# EAGLE design PentaFnord_0_9b (EAGLE 5.11)
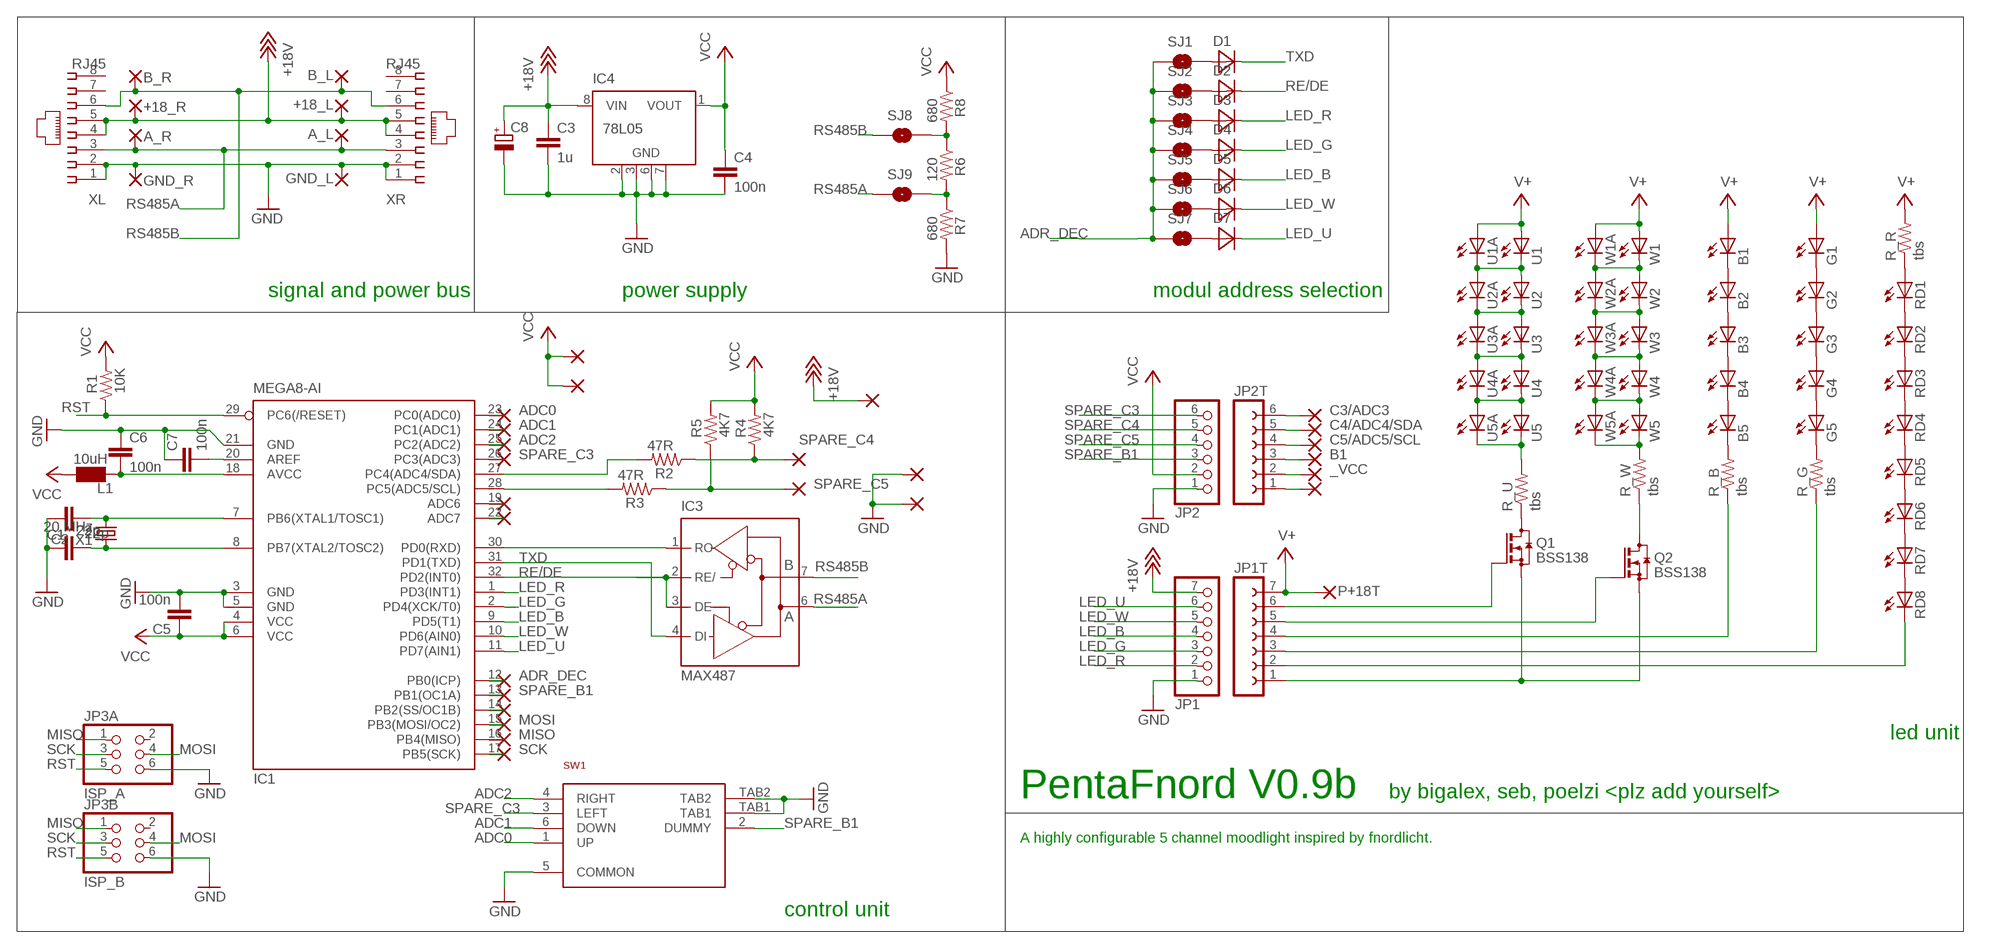
[diagram p0: schematic, sheet 1]

## Parts
+18_L  WIREPADSMD2,54-5,08  [SMD2,54-5,08]
+18_R  WIREPADSMD2,54-5,08  [SMD2,54-5,08]
A_L  WIREPADSMD2,54-5,08  [SMD2,54-5,08]
A_R  WIREPADSMD2,54-5,08  [SMD2,54-5,08]
ADC6  WIREPADSMD1,27-254  [SMD1,27-2,54]
ADC7  WIREPADSMD1,27-254  [SMD1,27-2,54]
B1  LED5MM  [LED5MM]
B2  LED5MM  [LED5MM]
B3  LED5MM  [LED5MM]
B4  LED5MM  [LED5MM]
B5  LED5MM  [LED5MM]
B_L  WIREPADSMD2,54-5,08  [SMD2,54-5,08]
B_R  WIREPADSMD2,54-5,08  [SMD2,54-5,08]
C1  22p  CAP0805  [0805]
C2  22p  CAP0805  [0805]
C3  1u  CAP0805  [0805]
C4  100n  CAP0805  [0805]
C5  100n  CAP0805  [0805]
C6  100n  CAP0805  [0805]
C7  100n  CAP0805  [0805]
C8  CPOL-EUSMCD  [SMC_D]
D1  DIODE_0805  [DIODE_0805]
D2  DIODE_0805  [DIODE_0805]
D3  DIODE_0805  [DIODE_0805]
D4  DIODE_0805  [DIODE_0805]
D5  DIODE_0805  [DIODE_0805]
D6  DIODE_0805  [DIODE_0805]
D7  DIODE_0805  [DIODE_0805]
G1  LED5MM  [LED5MM]
G2  LED5MM  [LED5MM]
G3  LED5MM  [LED5MM]
G4  LED5MM  [LED5MM]
G5  LED5MM  [LED5MM]
GND_L  WIREPADSMD2,54-5,08  [SMD2,54-5,08]
GND_R  WIREPADSMD2,54-5,08  [SMD2,54-5,08]
IC1  MEGA8-AI  [TQFP32-08]
IC3  MAX487  [SO08]
IC4  78L05  78L05SMD  [SO08]
JP1  PINHD-1X07_2.54-SMD-REVERSE  [1X07SMD-REVERSE]
JP1T  FE07-1  [FE07]
JP2  PINHD-1X06_2.54-SMD  [1X06SMD]
JP2T  FE06-1  [FE06]
JP3A  ISP_A  PINHD-2X03_2.54-SMD  [2X03SMD]
JP3B  ISP_B  PINHD-2X03_2.54-SMD  [2X03SMD]
L1  10uH  BEAD  [0805]
P+5T  WIREPAD2,54/0,8  [2,54/0,8]
P+18T  WIREPAD2,54/0,8  [2,54/0,8]
PAD1  WIREPADSMD1,27-254  [SMD1,27-2,54]
PAD2  WIREPADSMD1,27-254  [SMD1,27-2,54]
PAD3  WIREPADSMD1,27-254  [SMD1,27-2,54]
PAD4  WIREPADSMD1,27-254  [SMD1,27-2,54]
PAD5  WIREPADSMD1,27-254  [SMD1,27-2,54]
PB0  WIREPADSMD1,27-254  [SMD1,27-2,54]
PB1  WIREPADSMD1,27-254  [SMD1,27-2,54]
PB1T  WIREPAD2,54/0,8  [2,54/0,8]
PB2  WIREPADSMD1,27-254  [SMD1,27-2,54]
PB3  WIREPADSMD1,27-254  [SMD1,27-2,54]
PB4  WIREPADSMD1,27-254  [SMD1,27-2,54]
PB5  WIREPADSMD1,27-254  [SMD1,27-2,54]
PC0  WIREPADSMD1,27-254  [SMD1,27-2,54]
PC1  WIREPADSMD1,27-254  [SMD1,27-2,54]
PC2  WIREPADSMD1,27-254  [SMD1,27-2,54]
PC3  WIREPADSMD1,27-254  [SMD1,27-2,54]
PC3T  WIREPAD2,54/0,8  [2,54/0,8]
PC4  WIREPADSMD1,27-254  [SMD1,27-2,54]
PC4T  WIREPAD2,54/0,8  [2,54/0,8]
PC5  WIREPADSMD1,27-254  [SMD1,27-2,54]
PC5T  WIREPAD2,54/0,8  [2,54/0,8]
PGNDT1  WIREPAD2,54/0,8  [2,54/0,8]
Q1  BSS138  BSS123  [SOT23]
Q2  BSS138  BSS123  [SOT23]
R1  10K  RESISTOR0805-RES  [0805]
R2  47R  RESISTOR0805-RES  [0805]
R3  47R  RESISTOR0805-RES  [0805]
R4  4K7  RESISTOR0805-RES  [0805]
R5  4K7  RESISTOR0805-RES  [0805]
R6  120  RESISTOR0805-RES  [0805]
R7  680  RESISTOR0805-RES  [0805]
R8  680  RESISTOR0805-RES  [0805]
R_B  tbs  RESISTOR0805-RES  [0805]
R_G  tbs  RESISTOR0805-RES  [0805]
R_R  tbs  RESISTOR0805-RES  [0805]
R_U  tbs  RESISTOR1206  [1206]
R_W  tbs  RESISTOR1206  [1206]
RD1  LED5MM  [LED5MM]
RD2  LED5MM  [LED5MM]
RD3  LED5MM  [LED5MM]
RD4  LED5MM  [LED5MM]
RD5  LED5MM  [LED5MM]
RD6  LED5MM  [LED5MM]
RD7  LED5MM  [LED5MM]
RD8  LED5MM  [LED5MM]
SJ1  SOLDERJUMPERNO  [SJ_2S-NO]
SJ2  SOLDERJUMPERNO  [SJ_2S-NO]
SJ3  SOLDERJUMPERNO  [SJ_2S-NO]
SJ4  SOLDERJUMPERNO  [SJ_2S-NO]
SJ5  SOLDERJUMPERNO  [SJ_2S-NO]
SJ6  SOLDERJUMPERNO  [SJ_2S-NO]
SJ7  SOLDERJUMPERNO  [SJ_2S-NO]
SJ8  SOLDERJUMPERNO  [SJ_2S-NO]
SJ9  SOLDERJUMPERNO  [SJ_2S-NO]
SW1  MCMT5-F-V  [MCMT5-F-V]
U1  NICHIA_NSSL157T-H3  LED_PLCC2  [PLCC2]
U1A  LED5MM  [LED5MM]
U2  NICHIA_NSSL157T-H3  LED_PLCC2  [PLCC2]
U2A  LED5MM  [LED5MM]
U3  NICHIA_NSSL157T-H3  LED_PLCC2  [PLCC2]
U3A  LED5MM  [LED5MM]
U4  NICHIA_NSSL157T-H3  LED_PLCC2  [PLCC2]
U4A  LED5MM  [LED5MM]
U5  NICHIA_NSSL157T-H3  LED_PLCC2  [PLCC2]
U5A  LED5MM  [LED5MM]
W1  NICHIA_NSSL157T-H3  [NICHIA_NSSL157T-H3]
W1A  LED5MM  [LED5MM]
W2  NICHIA_NSSL157T-H3  [NICHIA_NSSL157T-H3]
W2A  LED5MM  [LED5MM]
W3  NICHIA_NSSL157T-H3  [NICHIA_NSSL157T-H3]
W3A  LED5MM  [LED5MM]
W4  NICHIA_NSSL157T-H3  [NICHIA_NSSL157T-H3]
W4A  LED5MM  [LED5MM]
W5  NICHIA_NSSL157T-H3  [NICHIA_NSSL157T-H3]
W5A  LED5MM  [LED5MM]
X1  20 MHz  CRYSTALSMD-SMALLER  [HC49UP-SMALL]
XL  RJ45  RJ45-SMDRJ45-SMALL  [85502-5008-SMALL]
XR  RJ45  RJ45-SMDRJ45-SMALL  [85502-5008-SMALL]

## Nets
+18V: +18_L.1(P) +18_R.1(P) C3.1 C8.+ IC4.8(VIN) JP1.7 PAD2.1(P) XL.4 XL.5 XR.4 XR.5
_VCC: JP2T.2 P+5T.1(P)
ADC0: IC1.23(PC0(ADC0)) PC0.1(P) SW1.1(UP)
ADC1: IC1.24(PC1(ADC1)) PC1.1(P) SW1.6(DOWN)
ADC2: IC1.25(PC2(ADC2)) PC2.1(P) SW1.4(RIGHT)
ADR_DEC: IC1.12(PB0(ICP)) PB0.1(P) SJ1.1 SJ2.1 SJ3.1 SJ4.1 SJ5.1 SJ6.1 SJ7.1
B1: JP2T.3 PB1T.1(P)
C3/ADC3: JP2T.6 PC3T.1(P)
C4/ADC4/SDA: JP2T.5 PC4T.1(P)
C5/ADC5/SCL: JP2T.4 PC5T.1(P)
GND: C1.1 C2.1 C3.2 C4.2 C5.2 C6.1 C7.1 C8.- GND_L.1(P) GND_R.1(P) IC1.3(GND) IC1.5(GND) IC1.21(GND) IC4.2(GND) IC4.3(GND) IC4.6(GND) IC4.7(GND) JP1.1 JP2.1 JP3A.6 JP3B.6 PAD1.1(P) PAD5.1(P) R7.2 SW1.5(COMMON) SW1.TAB1 SW1.TAB2 XL.1 XL.2 XR.1 XR.2
GND_T: JP1T.1 JP2T.1 PGNDT1.1(P) Q1.2(S) Q2.2(S)
LED_B: D5.1(C) IC1.9(PD5(T1)) JP1.4
LED_G: D4.1(C) IC1.2(PD4(XCK/T0)) JP1.3
LED_R: D3.1(C) IC1.1(PD3(INT1)) JP1.2
LED_U: D7.1(C) IC1.11(PD7(AIN1)) JP1.6
LED_W: D6.1(C) IC1.10(PD6(AIN0)) JP1.5
MISO: IC1.16(PB4(MISO)) JP3A.1 JP3B.1 PB4.1(P)
MOSI: IC1.15(PB3(MOSI/OC2)) JP3A.4 JP3B.4 PB3.1(P)
N$1: G5.K(C) R_G.2
N$2: W4.K@1(C) W4A.K(C) W5.A@2(A) W5A.A
N$3: U1.P$1(C) U1A.K(C) U2.P$2(A) U2A.A
N$4: ADC6.1(P) IC1.19(ADC6)
N$5: U3.P$1(C) U3A.K(C) U4.P$2(A) U4A.A
N$6: R_U.2 U5.P$1(C) U5A.K(C)
N$7: R_W.2 W5.K@1(C) W5A.K(C)
N$8: W3.K@1(C) W3A.K(C) W4.A@2(A) W4A.A
N$9: ADC7.1(P) IC1.22(ADC7)
N$10: U2.P$1(C) U2A.K(C) U3.P$2(A) U3A.A
N$11: B1.K(C) B2.A
N$12: U4.P$1(C) U4A.K(C) U5.P$2(A) U5A.A
N$13: G1.K(C) G2.A
N$14: G2.K(C) G3.A
N$15: G3.K(C) G4.A
N$16: G4.K(C) G5.A
N$17: B2.K(C) B3.A
N$18: B3.K(C) B4.A
N$19: B4.K(C) B5.A
N$20: B5.K(C) R_B.2
N$21: RD1.K(C) RD2.A
N$22: RD2.K(C) RD3.A
N$23: RD3.K(C) RD4.A
N$24: RD4.K(C) RD5.A
N$25: RD5.K(C) RD6.A
N$26: RD6.K(C) RD7.A
N$27: R_R.1 RD1.A
N$28: RD7.K(C) RD8.A
N$29: Q1.3(D) R_U.1
N$30: C6.2 IC1.18(AVCC) L1.2
N$31: R6.1 R8.2 SJ8.2
N$32: IC1.30(PD0(RXD)) IC3.1(RO)
N$34: W2.K@1(C) W2A.K(C) W3.A@2(A) W3A.A
N$35: C1.2 IC1.8(PB7(XTAL2/TOSC2)) X1.2
N$36: C2.2 IC1.7(PB6(XTAL1/TOSC1)) X1.1
N$37: Q2.3(D) R_W.1
N$38: R6.2 R7.1 SJ9.2
N$39: JP1T.6 Q1.1(G)
N$40: JP1T.5 Q2.1(G)
N$41: JP1T.3 R_G.1
N$42: JP1T.4 R_B.1
N$43: JP1T.2 RD8.K(C)
N$44: C7.2 IC1.20(AREF)
N$45: D1.2(A) SJ1.2
N$46: D2.2(A) SJ2.2
N$47: D3.2(A) SJ3.2
N$48: D4.2(A) SJ4.2
N$50: D5.2(A) SJ5.2
N$51: D6.2(A) SJ6.2
N$52: D7.2(A) SJ7.2
N$53: IC1.28(PC5(ADC5/SCL)) R3.2
N$54: W1.K@1(C) W1A.K(C) W2.A@2(A) W2A.A
N$55: IC1.14(PB2(SS/OC1B)) PB2.1(P)
N$59: IC1.27(PC4(ADC4/SDA)) R2.2
RE/DE: D2.1(C) IC1.32(PD2(INT0)) IC3.2(RE/) IC3.3(DE)
RS485A: A_L.1(P) A_R.1(P) IC3.6(A) SJ9.1 XL.3 XR.3
RS485B: B_L.1(P) B_R.1(P) IC3.7(B) SJ8.1 XL.6 XR.6
RST: IC1.29(PC6(/RESET)) JP3A.5 JP3B.5 R1.1
SCK: IC1.17(PB5(SCK)) JP3A.3 JP3B.3 PB5.1(P)
SPARE_B1: IC1.13(PB1(OC1A)) JP2.3 PB1.1(P) SW1.2(DUMMY)
SPARE_C3: IC1.26(PC3(ADC3)) JP2.6 PC3.1(P) SW1.3(LEFT)
SPARE_C4: JP2.5 PC4.1(P) R2.1 R4.1
SPARE_C5: JP2.4 PC5.1(P) R3.1 R5.1
TXD: D1.1(C) IC1.31(PD1(TXD)) IC3.4(DI)
V+: B1.A G1.A JP1T.7 P+18T.1(P) R_R.2 U1.P$2(A) U1A.A W1.A@2(A) W1A.A
VCC: C4.1 C5.1 IC1.4(VCC) IC1.6(VCC) IC4.1(VOUT) JP2.2 L1.1 PAD3.1(P) PAD4.1(P) R1.2 R4.2 R5.2 R8.1
Unconnected: IC4.4(NC) IC4.5(NC) JP3A.2 JP3B.2 XL.7 XL.8 XR.7 XR.8

## Notes on the sheet
- signal and power bus | power supply | modul address selection
- led unit
- PentaFnord V0.9b | by bigalex, seb, poelzi <plz add yourself>
- A highly configurable 5 channel moodlight inspired by fnordlicht.
- control unit

## Power pins joined to a net without a drawn wire
GND: IC3.5(GND)
VCC: IC3.8(VCC)

## Library data of the parts
+18_L +18_R A_L A_R ADC6 ADC7 B_L B_R GND_L GND_R P+5T P+18T PAD1-PAD5 PB0 PB1 PB1T PB2-PB5 PC0 PC1-PC3 PC3T PC4 PC4T PC5 PC5T PGNDT1 = wirepad:WIREPAD: Wire PAD connect wire on PCB
B1-B5 G1-G5 RD1-RD8 U1A U2A U3A U4A U5A W1A W2A W3A W4A W5A = Alex_personal:LED: LED OSRAM: - CHIPLED LG R971, LG N971, LY N971, LG Q971, LY Q971, LO R971, LY R971 LH N974, LH R974 LS Q976, LO Q976, LY Q976 LO Q996 - Hyper CHIPLED LW Q18S LB Q993, LB Q99A, LB R99A - SideLED LS A670, LO A670, LY A670, LG A670, LP A670 LB A673, LV A673, LT A673, LW A673 LH A674 LY A675 LS A676, LA A676, LO A676, LY A676, LW A676 LS A679, LY A679, LG A679 - Hyper Micro SIDELED® LS Y876, LA Y876, LO Y876, LY Y876 LT Y87S - SmartLED LW L88C, LW L88S LB L89C, LB L89S, LG L890 LS L89K, LO L89K, LY L89K LS L896, LA L896, LO L896, LY L896 - TOPLED LS T670, LO T670, LY T670, LG T670, LP T670 LSG T670, LSP T670, LSY T670, LOP T670, LYG T670 LG T671, LOG T671, LSG T671 LB T673, LV T673, LT T673, LW T673 LH T674 LS T676, LA T676, LO T676, LY T676, LB T676, LH T676, LSB T676, LW T676 LB T67C, LV T67C, LT T67C, LS T67K, LO T67K, LY T67K, LW E67C LS E67B, LA E67B, LO E67B, LY E67B, LB E67C, LV E67C, LT E67C LW T67C LS T679, LY T679, LG T679 LS T770, LO T770, LY T770, LG T770, LP T770 LB T773, LV T773, LT T773, LW T773 LH T774 LS E675, LA E675, LY E675, LS T675 LS T776, LA T776, LO T776, LY T776, LB T776 LHGB T686 LT T68C, LB T68C - Hyper Mini TOPLED® LB M676 - Mini TOPLED Santana® LG M470 LS M47K, LO M47K, LY M47K Source: http://www.osram.convergy.de LUXEON: - LUMILED® LXK2-PW12-R00, LXK2-PW12-S00, LXK2-PW14-U00, LXK2-PW14-V00 LXK2-PM12-R00, LXK2-PM12-S00, LXK2-PM14-U00 LXK2-PE12-Q00, LXK2-PE12-R00, LXK2-PE12-S00, LXK2-PE14-T00, LXK2-PE14-U00 LXK2-PB12-K00, LXK2-PB12-L00, LXK2-PB12-M00, LXK2-PB14-N00, LXK2-PB14-P00, LXK2-PB14-Q00 LXK2-PR12-L00, LXK2-PR12-M00, LXK2-PR14-Q00, LXK2-PR14-R00 LXK2-PD12-Q00, LXK2-PD12-R00, LXK2-PD12-S00 LXK2-PH12-R00, LXK2-PH12-S00 LXK2-PL12-P00, LXK2-PL12-Q00, LXK2-PL12-R00 Source: www.luxeon.com KINGBRIGHT: KA-3528ASYC Source: www.kingbright.com
C1-C7 = SparkFun:CAP: Capacitor Standard 0603 ceramic capacitor, and 0.1" leaded capacitor.
C8 = rcl:CPOL-EU: POLARIZED CAPACITOR, European symbol
D1-D7 = seb:DIODE_0805
IC1 = atmel:MEGA8: MICROCONTROLLER 8 Kbytes FLASH, 1 kbytes SRAM, 512 bytes EEPROM, USART, 6-channel 10 bit ADC, 2-channel 8 bit ADC Pin compatible with Atmega48, ATMega88, ATMega168 Source: avr.lbr; MPN: ATMEGA8-16AU; OC_FARNELL: 9171371; OC_NEWARK: 73M8863
IC3 = Alex_personal:MAX487: RS485 TRANSEIVER; MF: MAXIM; MPN: MAX487; OC_FARNELL: unknown; OC_NEWARK: unknown
IC4 = linear:78L*SMD: Positive VOLTAGE REGULATOR
JP1 = Alex_personal:PINHD-1X07: PIN HEADER
JP1T = con-lsta:FE07-1: FEMALE HEADER; OC_FARNELL: unknown; OC_NEWARK: unknown
JP2 = pinhead-2:PINHD-1X06: PIN HEADER
JP2T = con-lsta:FE06-1: FEMALE HEADER; OC_FARNELL: unknown; OC_NEWARK: unknown
JP3A JP3B = pinhead-2:PINHD-2X03: PIN HEADER
L1 = seb:BEAD
Q1 Q2 = transistor-small-signal:BSS123: N-CHANNEL MOS FET
R1-R8 R_B R_G R_R R_U R_W = SparkFun:RESISTOR: Resistor Basic schematic elements and footprints for 0603, 1206, and PTH resistors.
SJ1-SJ9 = SparkFun:SOLDERJUMPER: Solder Jumper Standard SMD solder jumper. Used to automate production. Two varients : Normally Open and Normally Closed are the same, but have different paste layers. NC will have a large amount of paste and should jumper during reflow.
SW1 = badge:MCMT5-F-V
U1-U5 = seb:LED_PLCC2
W1-W5 = seb:NICHIA_NSSL157T-H3
X1 = Alex_personal:CRYSTAL: Crystals Various standard crystals. Proven footprints. Spark Fun Electronics SKU : COM-00534
XL XR = Alex_personal:RJ45-SMD: AMP connector

## Board
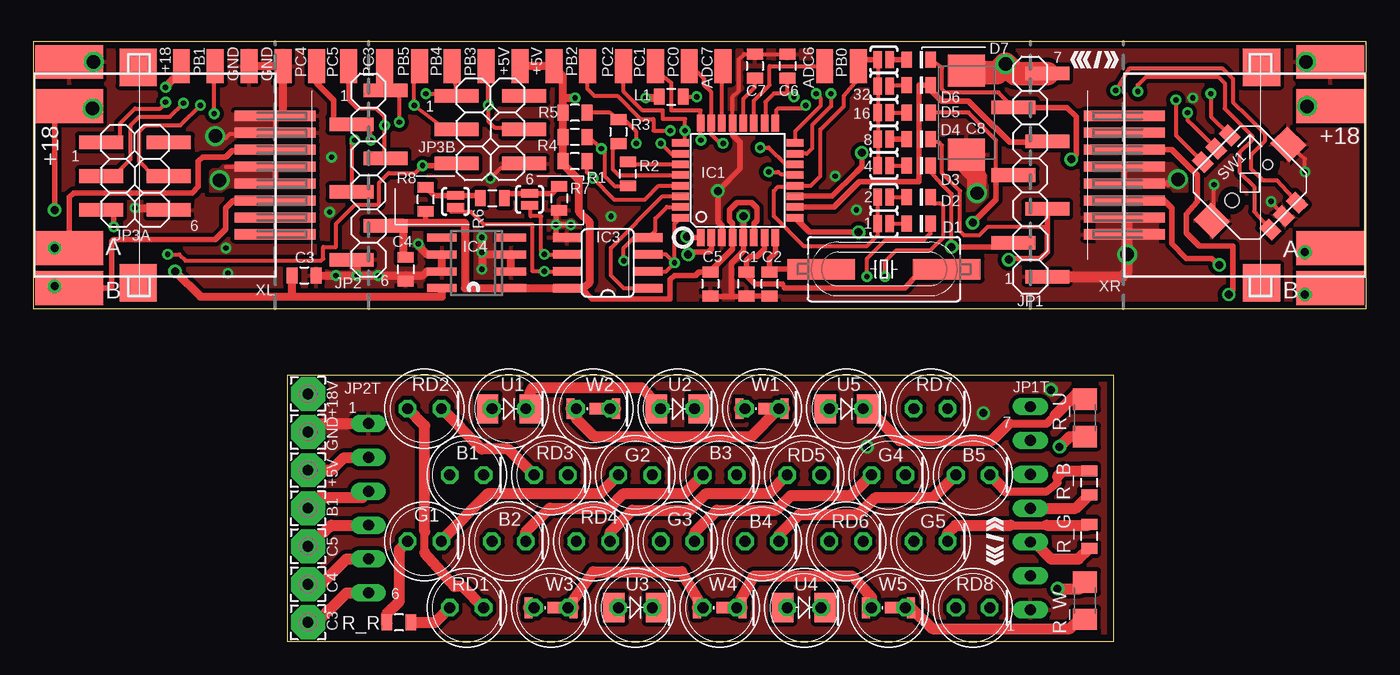
[diagram p1: board, top side]
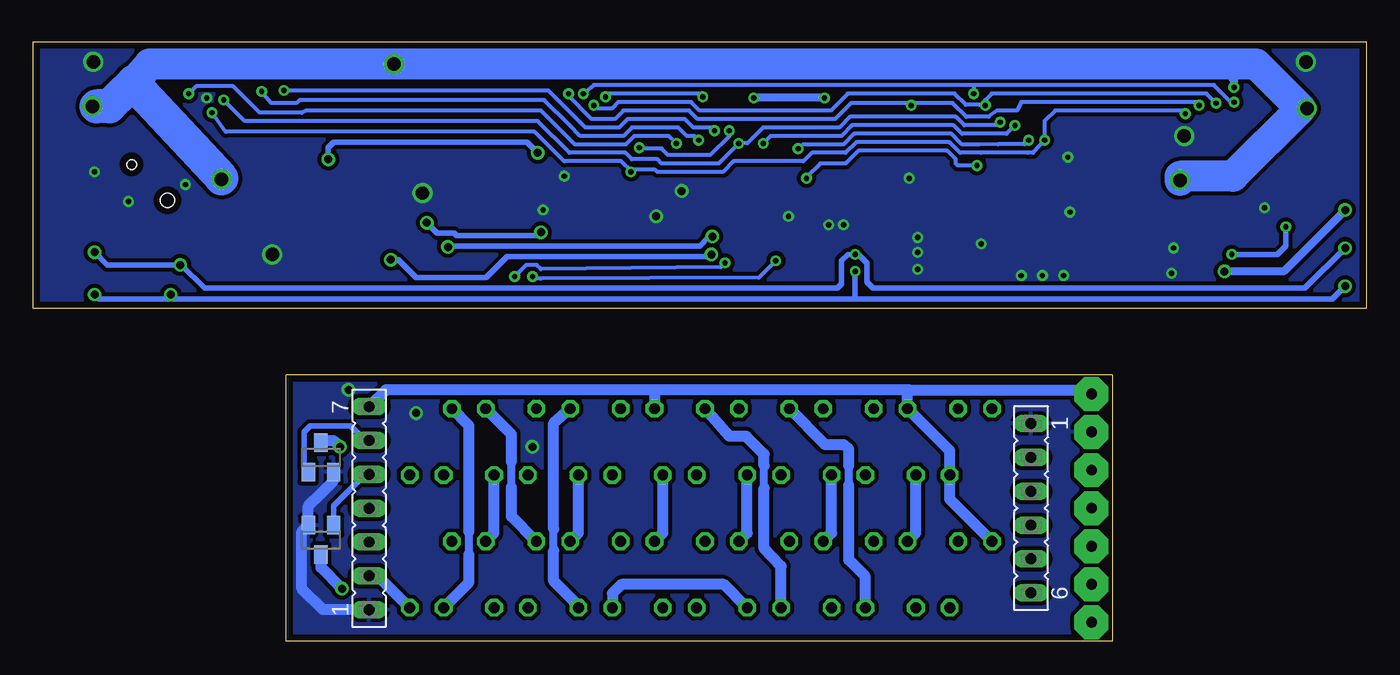
[diagram p2: board, bottom side, seen from below]

Size 100 x 45 mm. Coordinates in mm from the lower left corner, seen from the top.
Outline: 19.05,0 81.05,0 81.05,20 19.05,20 19.05,0
Outline: 100,25 100,45 0,45 0,25 100,25
Copper layers (1*16): Top 0.035mm / dielectric 1.5mm / Bottom 0.035mm
Design rules "default *": minimum track width 12mil, minimum drill 0.4mm, track to track 10mil, track to pad 10mil, pad to pad 8mil, via to via 10mil, smd to smd 8mil, copper to edge 20mil, drill to drill 8mil, minimum pad ring 10mil, minimum via ring 8mil, stop-mask expansion 4mil, vias tented up to drill 40mil, thermal gap 10mil

### Footprints (pad centres in the part's own frame; a part is rotated, then mirrored left to right if it is on the bottom)
SMD2,54-5,08 = smd 2.54 x 5.08: 1 0,0
SMD1,27-2,54 = smd 1.27 x 2.54: 1 0,0
LED5MM = drill 0.813 octagon: A -1.27,0; K 1.27,0
0805 = smd 0.8 x 1.2: 1 -0.9,0; 2 0.9,0
SMC_D = smd 2.4 x 2.8: + -3.15,0; - 3.15,0
DIODE_0805 = smd 0.8 x 1.2: 1 -0.9,0; 2 0.9,0
TQFP32-08 = smd 1.27 x 0.559: 1 -4.293,2.8; 2 -4.293,2; 3 -4.293,1.2; 4 -4.293,0.4; 5 -4.293,-0.4; 6 -4.293,-1.2; 7 -4.293,-2; 8 -4.293,-2.8; 17 4.293,-2.8; 18 4.293,-2; 19 4.293,-1.2; 20 4.293,-0.4; 21 4.293,0.4; 22 4.293,1.2; 23 4.293,2; 24 4.293,2.8 | smd 0.559 x 1.27: 9 -2.8,-4.293; 10 -2,-4.293; 11 -1.2,-4.293; 12 -0.4,-4.293; 13 0.4,-4.293; 14 1.2,-4.293; 15 2,-4.293; 16 2.8,-4.293; 25 2.8,4.293; 26 2,4.293; 27 1.2,4.293; 28 0.4,4.293; 29 -0.4,4.293; 30 -1.2,4.293; 31 -2,4.293; 32 -2.8,4.293
SO08 = smd 0.66 x 2.032: 1 -1.905,-3.073; 2 -0.635,-3.073; 3 0.635,-3.073; 4 1.905,-3.073; 5 1.905,3.073; 6 0.635,3.073; 7 -0.635,3.073; 8 -1.905,3.073
SO08' = smd 0.6 x 2.2: 1 -1.905,-2.6; 2 -0.635,-2.6; 3 0.635,-2.6; 4 1.905,-2.6; 5 1.905,2.6; 6 0.635,2.6; 7 -0.635,2.6; 8 -1.905,2.6
1X07SMD-REVERSE = smd 1.016 x 3.302: 1 -1.27,-1.27; 2 1.27,1.27; 3 3.81,-1.27; 4 6.35,1.27; 5 8.89,-1.27; 6 11.43,1.27; 7 13.97,-1.27
FE07 = drill 0.813 long: 1 -7.62,0; 2 -5.08,0; 3 -2.54,0; 4 0,0; 5 2.54,0; 6 5.08,0; 7 7.62,0
1X06SMD = smd 1.016 x 3.302: 1 -1.27,1.27; 2 1.27,-1.27; 3 3.81,1.27; 4 6.35,-1.27; 5 8.89,1.27; 6 11.43,-1.27
FE06 = drill 0.813 long: 1 -6.35,0; 2 -3.81,0; 3 -1.27,0; 4 1.27,0; 5 3.81,0; 6 6.35,0
2X03SMD = smd 1.016 x 3.302: 1 -1.27,-3.81; 2 -1.27,1.27; 3 1.27,-3.81; 4 1.27,1.27; 5 3.81,-3.81; 6 3.81,1.27
2,54/0,8 = drill 0.813 pad 2.54 octagon: 1 0,0
SOT23 = smd 1 x 1.4: 1 -0.95,-1.1; 2 0.95,-1.1; 3 0,1.1
1206 = smd 1.6 x 1.8: 1 -1.4,0; 2 1.4,0
SJ_2S-NO = smd 0.635 x 1.27: 1 -0.45,0; 2 0.45,0
MCMT5-F-V = smd 1.35 x 1: 1 -3.575,1.425; 2 -3.575,0; 3 -3.575,-1.425; 4 3.575,1.425; 5 3.575,0; 6 3.575,-1.425 | smd 2 x 1.8: TAB1 0,4.05; TAB2 0,-4.05 | hole 1.05: 0,-1.9 | hole 0.75: 0,1.9
PLCC2 = smd 1.6 x 2.2: P$1 -1.6,0; P$2 1.6,0
NICHIA_NSSL157T-H3 = smd 0.64 x 0.86: A@1 1.08,0 | smd 0.6 x 1.55: A@2 1.7,0; K@1 -1.7,0 | smd 1.66 x 0.86: K@2 -0.57,0
HC49UP-SMALL = smd 5.08 x 1.524: 1 -4.699,0; 2 4.699,0
85502-5008-SMALL = smd 6.096 x 0.762: 1 10.211,4.445; 2 10.211,3.175; 3 10.211,1.905; 4 10.211,0.635; 5 10.211,-0.635; 6 10.211,-1.905; 7 10.211,-3.175; 8 10.211,-4.445 | smd 2.794 x 2.794: P$1 -0.076,-8.077; P$2 -0.076,8.077

### Placement (x,y rotation side)
+18_L  2.7,40.16 90 top
+18_R  97.31,40.16 90 top
A_L  2.7,29.53 90 top
A_R  97.31,29.53 90 top
ADC6  59.37,43.18 0 top
ADC7  51.75,43.18 180 top
B1  32.51,12.49 0 top
B2  35.68,7.51 0 top
B3  51.5,12.49 0 top
B4  54.67,7.51 0 top
B5  70.49,12.49 0 top
B_L  2.7,26.51 90 top
B_R  97.31,26.51 90 top
C1  55.24,26.83 90 top
C2  53.5,26.83 90 top
C3  20.32,27.46 0 top
C4  27.94,27.94 270 top
C5  50.8,26.83 270 top
C6  56.59,43.18 270 top
C7  54.13,43.18 270 top
C8  70.01,39.69 270 top
D1  66.44,31.35 180 top
D2  66.44,33.34 180 top
D3  66.44,35.72 180 top
D4  66.44,37.7 180 top
D5  66.44,39.69 180 top
D6  66.44,41.75 180 top
D7  66.44,43.66 180 top
G1  29.35,7.51 0 top
G2  45.17,12.49 0 top
G3  48.34,7.51 0 top
G4  64.16,12.49 0 top
G5  67.33,7.51 0 top
GND_L  2.7,43.5 90 top
GND_R  97.31,43.5 90 top
IC1  52.86,34.61 90 top
IC3  43.1,28.42 90 top
IC4  78L05  [SO08']  33.26,28.42 90 top
JP1  74.8,28.65 90 top
JP1T  74.8,10 90 bottom
JP2  25.15,29.92 90 top
JP2T  25.15,10 270 bottom
JP3A  8.89,36.19 270 top
JP3B  35.56,39.69 270 top
L1  47.86,40.88 0 top
P+5T  20.61,12.86 0 top
P+18T  20.61,18.57 0 top
PAD1  16.19,43.18 0 top
PAD2  11.11,43.18 0 top
PAD3  39.05,43.18 0 top
PAD4  36.51,43.18 0 top
PAD5  18.73,43.18 0 top
PB0  61.91,43.18 180 top
PB1  13.65,43.18 180 top
PB1T  20.61,10 0 top
PB2  41.59,43.18 180 top
PB3  33.97,43.18 180 top
PB4  31.43,43.18 180 top
PB5  28.97,43.18 180 top
PC0  49.21,43.18 0 top
PC1  46.67,43.18 0 top
PC2  44.29,43.18 0 top
PC3  26.35,43.18 0 top
PC3T  20.61,1.43 0 top
PC4  21.27,43.18 0 top
PC4T  20.61,4.29 0 top
PC5  23.65,43.18 0 top
PC5T  20.61,7.14 0 top
PGNDT1  20.61,15.72 0 top
Q1  78.42,13.81 0 bottom
Q2  78.42,7.62 180 bottom
R1  40.64,36.04 180 top
R2  44.61,35.08 90 top
R3  43.89,38.26 270 top
R4  40.64,37.86 180 top
R5  40.64,39.69 180 top
R6  34.45,33.26 0 top
R7  39.45,33.26 270 top
R8  29.45,33.18 90 top
R_B  79.22,11.91 90 top
R_G  79.22,7.89 90 top
R_R  27.43,1.43 180 top
R_U  78.9,16.78 90 top
R_W  78.9,3.06 270 top
RD1  32.51,2.53 0 top
RD2  29.35,17.47 0 top
RD3  38.84,12.49 0 top
RD4  42.01,7.51 0 top
RD5  57.83,12.49 0 top
RD6  61,7.51 0 top
RD7  67.33,17.47 0 top
RD8  70.49,2.53 0 top
SJ1  63.82,31.35 0 top
SJ2  63.82,33.34 0 top
SJ3  63.82,35.72 0 top
SJ4  63.82,37.7 0 top
SJ5  63.82,39.69 0 top
SJ6  63.82,41.67 0 top
SJ7  63.82,43.66 0 top
SJ8  31.67,33.02 90 top
SJ9  37.23,33.18 90 top
SW1  91.28,34.45 315 top
U1  35.68,17.45 180 top
U1A  35.68,17.47 0 top
U2  48.34,17.46 180 top
U2A  48.34,17.47 0 top
U3  45.16,2.55 180 top
U3A  45.17,2.53 0 top
U4  57.82,2.55 180 top
U4A  57.83,2.53 0 top
U5  61,17.46 180 top
U5A  61,17.47 0 top
W1  54.67,17.47 180 top
W1A  54.67,17.47 0 top
W2  42.01,17.47 180 top
W2A  42.01,17.47 0 top
W3  38.84,2.53 180 top
W3A  38.84,2.53 0 top
W4  51.5,2.53 180 top
W4A  51.5,2.53 0 top
W5  64.16,2.53 180 top
W5A  64.16,2.53 0 top
X1  63.82,27.94 180 top
XL  7.94,35 0 top
XR  92.08,35 180 top

### Tracks (layer width: path | path; a pad name or v marks a point on that pad's centre or on a via)
+18V  (via drill 0.4, 0.6, 1)
  Top 0.305: 11.11,42.86 PAD2.1 | +18_L.1 | 14.45,35.63 XL.4
  Top 0.406: 97.16,40.16 +18_R.1 | XL.4 XL.5 | 81.76,35.62 XR.5 XR.4 85.17,34.37 | 1.67,32.46 1.59,32.46 1.59,39.53 +18_L.1 v4.45,40.01 | 14.13,34.61 13.49,34.45 | 97.16,40.16 | v95.57,40.16 97.16,40.16
  Top 0.61: v1.59,32.38 1.67,32.46 | v10.64,27.78 12.54,25.88 19.53,25.88 | 19.53,25.88 30.66,25.88 IC4.8 | C3.1 19.42,25.98 19.53,25.88 | JP1.7 75.64,42.62 75.56,42.7 | v9.92,41.59 11.11,42.86 | 70.14,42.7 arc-90 C8.+ | 85.17,34.37 85.88,34.76 v85.88,34.69
  Top 1.778: 70.14,42.7 72.31,42.7 v72.95,43.34 73.67,42.62 JP1.7
  Bottom 0.305: 9.53,43.33 10.32,42.54 | 5.4,39.53 4.6,39.53 4.45,39.37 v4.45,40.01 5.56,39.53 5.4,39.53 | 5.4,39.53 4.92,40.01 | v13.97,34.61 14.45,35.4 14.45,34.92 13.97,34.92
  Bottom 0.406: 42.55,43.81 43.34,43.81 43.34,43.33 | 85.57,34.77 85.88,34.77 | 73.74,42.7 74.14,43.34 77.95,43.33 | v95.57,40.16 94.85,40.88 93.58,40.88
  Bottom 0.61: v1.59,32.38 6.19,27.78 v10.64,27.78 | 10.32,42.54 9.92,42.14 v9.92,41.59 | 73.74,42.7 73.1,43.34 v72.95,43.34 | 85.57,34.77 86.52,35.72 | 86.52,35.72 87,35.72 86.04,34.77 | 86.04,34.77 | 86.52,35.72 86.68,35.88 v85.88,34.69
  Bottom 2.311: 92.47,41.99 91.28,43.33 77.95,43.33 43.34,43.33 9.53,43.33 8.25,43.33 4.92,40.01 10,34.92 13.97,34.92 v13.97,34.61
  Bottom 2.54: 95.25,40.16 94.3,40.16 93.58,40.88 92.47,41.99 92.47,41.83 85.88,34.77
  pour Top (no thermals): 86.52,33.81 85.57,33.81 85.41,34.13 81.76,34.13 81.76,35.72 81.92,35.88 85.41,35.88 86.52,34.77
  pour Top (no thermals): 13.49,35.4 13.97,35.4 14.29,35.72 18.1,35.72 18.26,35.56 18.26,34.45 15.24,34.45 14.92,34.13 14.61,34.13 14.13,33.81 13.34,33.81 13.34,35.24
_VCC
  Top 0.813: JP2T.2 23.34,13.81 22.38,12.86 P+5T.1
ADC0  (via drill 0.4)
  Top 0.305: v88.34,41.12 88.34,39.4 SW1.1 | PC0.1 49.37,42.23 | 49.37,42.23 | PC0.1 49.21,42.39 | PC0.1 49.37,43.18 50.32,42.23 50.32,41.75 50.86,41.21 IC1.23 50.86,38.04 51.51,37.39 v51.75,37.39
  Bottom 0.305: v88.34,41.12 87.79,41.67 85.01,41.67 83.03,39.69 80.8,39.69 79.85,39.69 79.53,39.85 61.91,39.85 59.37,37.31 55.56,37.31 54.93,37.94 52.31,37.94 v51.75,37.39
ADC1  (via drill 0.4, 0.4 pad 0.01)
  Top 0.305: 92.71,30.48 SW1.6 91.6,32.27 91.6,34.13 90.49,35.24 90.49,36.67 91.44,37.62 91.44,37.94 89.38,40.01 89.38,41.91 88.9,42.39 83.5,42.39 82.87,41.75 v82.87,41.27 | PC1.1 46.83,43.02 46.83,42.7 46.91,42.7 47.86,41.91 47.86,39.85 50.07,39.85 IC1.24 50.06,37.65 v50.09,37.62
  Bottom 0.305: v82.87,41.27 82.15,40.4 80.25,40.4 80.01,40.64 78.74,40.64 61.67,40.64 59.73,38.7 58.98,37.94 55.72,37.94 55.09,38.58 51.59,38.58 50.96,37.94 50.4,37.94 v50.09,37.62
ADC2  (via drill 0.4)
  Top 0.305: 95.25,33.02 SW1.4 93.3,34.61 92.23,34.61 91.36,35.48 91.36,36.51 92.39,37.54 92.39,38.1 91.12,39.37 | 91.12,39.37 | 91.12,39.37 90.01,40.48 90.01,42.23 89.22,43.02 82.23,43.02 v81.2,41.35 | IC1.25 48.9,37.41 v48.9,38.34 48.9,39.21 47.23,39.21 47.23,39.85 45.72,39.85 44.29,41.28 PC2.1
  Bottom 0.305: v81.2,41.35 61.36,41.35 58.58,38.58 56.04,38.58 55.4,39.21 51.12,39.21 50.48,38.58 49.13,38.58 v48.9,38.34
ADR_DEC
  Top 0.305: SJ7.1 SJ6.1 | 62.05,43.61 61.91,43.47 61.91,42.23 60.8,40.96 60.8,40.16 59.05,38.42 59.05,34.92 58.34,34.21 IC1.12 57.08,34.13 55.88,34.13 55.56,33.81 55.56,31.91 57.78,29.69 62.55,29.69 63.37,30.51 SJ1.1 | SJ1.1 | SJ1.1 SJ2.1 | SJ6.1 | SJ6.1 | SJ6.1 SJ5.1 SJ4.1 | SJ4.1 | SJ4.1 SJ3.1
  Top 0.406: PB0.1 62.05,43.61 62.07,43.66 SJ7.1
B1
  Top 0.813: PB1T.1 21.24,10.79 24.67,10.79 JP2T.3
C3/ADC3
  Top 0.813: JP2T.6 23.49,3.65 21.27,1.43 PC3T.1
C4/ADC4/SDA
  Top 0.813: JP2T.5 23.49,6.19 21.59,4.29 PC4T.1
C5/ADC5/SCL
  Top 0.813: JP2T.4 22.35,8.73 PC5T.1
GND  (via drill 0.4, 0.6, 1)
  Top 0.305: C7.1 53.34,44.08 52.94,43.68 52.94,41.35 52.46,40.88 52.46,40.25 IC1.21 | 36.83,35.56 35.08,35.56 v34.29,34.77 | C7.1 | C7.1 C6.1 | v92.87,33.02 | SW1.5 v92.87,33.02 | v95.41,35.24 95.41,36.21 SW1.TAB1 | v88.58,34.29 88.58,31.59 SW1.TAB2 | XL.1 XL.2 18.2,38.1 14.76,38.1 14.45,37.78 | v13.65,37.94 14.45,37.78 | 13.65,38.26 13.97,38.26 14.45,37.78 | 13.65,37.39 13.57,37.54 13.18,37.94
  Top 0.406: 96.52,42.86 GND_R.1 | SW1.TAB1 93.99,36.66 | IC3.5 39.21,30.32 v39.21,31.27 | v39.21,31.27 v40.32,31.27 | 36.83,35.56 JP3B.6 | R7.2 39.21,32.12 v39.21,31.27 | IC1.21 52.46,38.02 53.02,37.47 53.02,35.48 v51.36,33.81 51.36,31.51 51.66,31.2 IC1.3 | 53.26,29.29 IC1.5 v53.26,31.91 | 52.39,25.88 53.45,25.88 C2.1 C1.1 | 53.26,29.29 | 53.26,29.29 52.39,28.42 52.39,25.88 | 52.39,25.88 50.85,25.88 C5.2
  Top 0.61: 10.95,32.38 JP3A.6 9.84,32.54 v7.62,32.54 | 3.02,43.18 3.49,43.18 3.25,42.94 3.02,43.18 | 3.02,43.18 GND_L.1 | 3.02,43.18 | 22.54,28.73 23.79,28.73 JP2.1 24.29,28.24 v24.29,27.46 | C3.2 v22.7,27.46 | v22.7,27.46 | v22.7,27.46 v24.29,27.46 | v24.29,27.46 | v24.29,27.46 27.94,27.46 | 27.94,27.46 29.21,27.46 29.53,27.78 IC4.7 IC4.6 29.53,29.05 28.89,29.69 v28.89,29.84 | 27.94,27.46 C4.2 | IC4.2 IC4.3 33.81,29.05 arc-90 v33.66,29.21 | v33.66,29.21 v33.66,27.94 | v33.66,29.21 v33.66,30.32 | PAD1.1 PAD5.1 18.73,39.45 XL.1 | 71.28,33.81
  Top 0.813: 82.07,30.89 82.07,31.49 XR.2 | 82.07,30.89 v82.07,29.05 82.07,27.78 81.67,27.38 JP1.1 | 82.07,30.89 XR.1
  Top 1.422: v70.8,33.66 | v70.8,33.66 70.8,34.92 70.01,35.72 C8.-
  other vias: 4.52,43.5 95.49,43.5 25.88,27.46 14.45,29.53 14.61,27.62 43.34,31.91 22.38,36.35 22.23,32.23 87,40.8 61.75,32.38 60.17,34.92
  pour Bottom (isolate 0.305): -0.16,24.92 100.17,24.92 100.17,45.09 -0.16,45.09
  pour Top (isolate 0.305, rank 2): 100.17,45.09 100.17,24.92 -0.16,24.92 -0.16,45.09
  pour Top (no thermals): 79.85,28.42 79.85,31.59 84.3,31.59 84.3,28.42
  pour Top (no thermals): 18.26,39.53 14.76,39.53 13.97,38.58 13.02,38.26 13.02,37.47 13.34,37.15 13.81,37.15 14.13,37.47 14.76,37.47 15.24,37.94 18.26,37.94
GND_T  (via drill 0.6)
  Top 0.813: JP2T.1 21.08,16.35 PGNDT1.1
  Bottom 0.813: Q1.2 77.47,12.06 78.42,11.11 79.37,10.16 Q2.2 79.85,8.24 79.85,3.97 78.26,2.38 JP1T.1
  other vias: 62.55,14.61 76.36,18.89 71.28,17.14
  pour Bottom (isolate 0.305): 19.05,20 81.05,20 81.05,0 19.05,0
  pour Top (isolate 0.305): 19.05,20 81.05,20 81.05,0 19.05,0
LED_B  (via drill 0.6)
  Top 0.305: 72.55,35.4 73.18,34.77 73.3,34.77 JP1.4 | D5.1 70.17,39.69 72.23,37.62 72.23,34.92
  Top 0.406: IC1.9 58.24,30.72 v61.91,30.72 | v70.48,31.43 72.23,33.18 72.23,34.92 72.23,35.08 72.31,35 JP1.4
  Bottom 0.406: v61.91,30.72 62.15,30.48 68.26,30.48 68.42,30.64 69.69,30.64 v70.48,31.43
LED_G  (via drill 0.6)
  Top 0.305: D4.1 67.5,37.47 67.94,37.47 68.18,37.23 68.18,35.16 69.53,33.81 69.53,30.8 69.85,30.48 70.96,30.48 71.6,31.11 75.75,31.11 arc-90 76.07,30.8
  Top 0.406: v49.13,29.05 49.29,29.21 50.64,29.21 50.86,29.43 IC1.2 | JP1.3 76.07,30.8 76.07,29.24 75.56,28.73 73.26,28.73 v73.18,28.65
  Bottom 0.406: v49.13,29.05 49.29,28.89 64.45,28.89 66.04,27.3 71.28,27.3 72.63,28.65 v73.18,28.65
LED_R  (via drill 0.6)
  Top 0.305: D3.1 67.34,35.22 68.18,34.29 68.9,33.58 v68.9,29.61
  Top 0.406: IC1.1 49.14,30.32 v49.05,30.4 | JP1.2 72.16,29.92 72.07,30 72.07,29.61 v68.9,29.61
  Bottom 0.406: v49.05,30.4 49.14,30.32 49.37,30.32 50,29.69 68.82,29.69 arc-90 v68.9,29.61
LED_U  (via drill 0.6)
  Top 0.305: D7.1 68.18,43.05 68.18,41.43 68.42,41.2 72.42,41.2 JP1.6
  Top 0.406: IC1.11 59.92,33.41 61.75,35.24 | v77.87,36.2 78.26,36.59 78.26,39.37 77.55,40.08 JP1.6 | 61.75,35.24 | 61.75,35.24 62.15,35.64 v62.15,36.67
  Bottom 0.406: v62.15,36.67 62.94,37.47 77.47,37.47 77.87,37.07 v77.87,36.2
LED_W
  Top 0.406: 76.12,37.54 JP1.5 75.99,37.46 73.27,37.46 70.96,39.77 | IC1.10 60.07,32.61 61.99,34.53 66.44,34.53 66.44,41.75 D6.1 | D6.1 | 70.96,39.77 | D6.1 67.47,41.62 67.47,41.27 68.18,40.56 70.17,40.56 70.96,39.77
MISO  (via drill 0.4)
  Top 0.305: PB4.1 31.59,43.02 JP3B.1 31.59,41.12 v29.45,41.12 | IC1.16 57.16,38.27 59.05,40.16 59.05,40.8 v58.74,41.12 | 5.08,37.62 5.24,37.78 6.51,37.78 6.51,38.89 7.62,40.01 9.53,40.01 9.92,40.4 v9.92,40.48
  Top 0.406: JP3A.1 5.08,37.62 4.92,37.47
  Bottom 0.305: v58.74,41.12 57.94,41.75 29.37,41.75 | 29.37,41.75 11.43,41.75 10.16,40.48 v9.92,40.48 | v29.45,41.12 29.45,41.67 arc90 29.37,41.75
MOSI  (via drill 0.4)
  Top 0.305: JP3B.4 36.67,38.58 34.61,38.58 34.13,39.05 v34.13,40.24 34.13,40.09 34.13,43.02 PB3.1 | IC1.15 58.04,36.61 58.42,36.99 58.42,38.73 59.85,40.16 v59.85,41.12 | JP3A.4 9.05,34.92 7.94,36.04 7.94,38.26 8.41,38.73 11.03,38.73 v12.54,40.24
  Bottom 0.305: v59.85,41.12 59.85,40.96 58.1,39.21 56.36,39.21 55.72,39.85 50.8,39.85 50.16,39.21 39.85,39.21 38.66,40.4 34.13,40.4 | 34.13,40.4 v34.13,40.24 | 34.13,40.4 | v12.54,40.24 12.78,40.48 25.88,40.48 26.19,39.85 27.7,39.85 28.34,39.37 30,39.37 31.04,40.4 34.13,40.4
N$1
  Top 0.61: 73.34,8.73 76.04,8.73
  Top 0.813: 73.34,8.73 69.22,8.73 68.6,8.11 G5.K | 76.04,8.73 79.16,8.73 R_G.2
N$2
  Top 0.305: W5A.A W5.A@2
  Top 0.813: W5A.A 62.89,3.31 62.34,3.91 61.44,4.92 54.05,4.92 W4A.K W4.K@1
N$3
  Top 0.813: U1A.K U1.P$1 37.28,18.7 37.47,19.05 45.65,19.05 U2A.A U2.P$2
N$4
  Top 0.305: ADC6.1 56.04,43.18 55.24,43.18 55.24,41.75 54.06,40.57 IC1.19
N$5
  Top 0.813: U3A.K U3.P$1 | U4A.A U4.P$2
  Bottom 0.813: U4A.A 56.56,3.6 55.88,4.29 48.2,4.29 U3A.K
N$6
  Top 0.61: 73.18,16.35 76.04,16.35 76.68,16.99
  Top 0.813: 73.18,16.35 71.91,15.08 64.99,15.08 U5.P$1 U5A.K | 78.26,18.1 78.26,18.42 R_U.2 78.26,18.57 76.68,16.99
N$7
  Top 0.813: R_W.2 78.26,1.43 77.79,0.95 67.44,0.95 W5.K@1 W5A.K
N$8
  Top 0.813: W3.K@1 W3A.K 42.03,5.24 48.63,5.24 W4A.A W4.A@2
N$9
  Top 0.305: 51.59,43.02 ADC7.1 51.66,43.18 51.66,40.09 IC1.22
N$10
  Top 0.813: U3A.A U3.P$2 | U2A.K U2.P$1
  Bottom 0.61: 45.16,11.51 45.16,13.18
  Bottom 0.813: U3A.A 43.9,5.64 45.16,6.99 45.16,11.51 | 45.16,13.18 45.16,14.05 46.51,15.4 47.78,15.4 U2A.K
N$11
  Bottom 0.813: B1.K 33.78,8.13 B2.A
N$12
  Top 0.406: U5A.A U5.P$2
  Top 0.813: U4A.K U4.P$1
  Bottom 0.61: 60.96,6.83 60.96,8.41
  Bottom 0.813: U5A.A 60.96,16.4 60.96,8.41 | 60.96,6.83 60.96,4.55 59.1,2.69 U4A.K
N$13
  Top 0.813: G2.A 42.52,11.11 34.13,11.11 30.62,7.6 G1.K
N$14
  Bottom 0.813: G2.K 46.44,8.13 G3.A
N$15
  Top 0.813: G4.A 61.36,10.95 56.83,10.95 55.72,9.84 51.28,9.84 49.61,8.17 G3.K
N$16
  Bottom 0.813: G4.K 65.43,8.13 G5.A
N$17
  Top 0.813: B3.A 48.85,11.11 44.29,11.11 43.18,10 38.73,10 36.95,8.21 B2.K
N$18
  Bottom 0.813: B3.K 52.77,8.13 B4.A
N$19
  Top 0.813: B5.A 67.53,10.79 63.18,10.79 61.91,9.53 57.47,9.53 55.94,8 B4.K
N$20
  Top 0.61: 76.83,12.38 76.83,11.91 76.04,11.27 72.98,11.27
  Top 0.813: B5.K 72.77,11.49 72.98,11.27 | R_B.2 77.26,12.81 76.83,12.38
N$21
  Top 0.61: 29.37,6.67 29.37,8.26
  Top 0.813: RD2.A 29.37,16.18 29.37,8.26 | 29.37,6.67 31.59,4.13 32.23,4.13 32.23,4.09 RD1.K
N$22
  Top 0.813: RD2.K 33.64,14.45 35.62,14.45 RD3.A
N$23
  Bottom 0.813: RD3.K 40.11,8.13 RD4.A
N$24
  Top 0.813: RD5.A 55.18,11.11 50.48,11.11 49.21,9.84 44.93,9.84 43.28,8.19 RD4.K
N$25
  Bottom 0.813: RD5.K 59.1,8.13 RD6.A
N$26
  Bottom 0.61: 64.14,11.59 64.14,13.49
  Bottom 0.813: RD6.K 64.14,9.38 64.14,11.59 | 64.14,13.49 64.14,15.55 RD7.A
N$27
  Top 0.813: R_R.1 30.14,1.43 RD1.A
N$28
  Bottom 0.61: 67.31,6.51 67.31,8.26
  Bottom 0.813: RD7.K 67.31,16.18 67.31,8.26 | 67.31,6.51 67.31,4.44 RD8.A
N$29  (via drill 0.6)
  Top 0.813: R_U.1 77.77,15.38 v76.99,14.61
  Bottom 0.406: Q1.3 78.25,15.08
  Bottom 0.813: 78.25,15.08 77.47,15.08 v76.99,14.61
N$30  (via drill 0.4, 0.4 pad 0.4)
  Top 0.305: L1.2 v49.77,40.88 | IC1.18 54.93,38.96 54.93,40.48 55.56,41.12 56.52,41.12 | 56.52,41.12 56.83,41.12 v57.07,40.88 | C6.2 56.59,41.2 56.52,41.12
  Bottom 0.305: v57.07,40.88 56.83,41.12 50.01,41.12 v49.77,40.88
N$31
  Top 0.406: R6.1 33.55,33.47 SJ8.2 30.06,33.47 R8.2
N$32
  Top 0.305: 45.32,26.67 46.02,26.67 IC3.1 44.29,26.51 43.34,27.46 43.34,29.53 47.22,33.41 IC1.30
N$34
  Top 0.813: W3A.A W3.A@2 | W2A.K W2.K@1
  Bottom 0.61: 38.81,11.75 38.81,13.18
  Bottom 0.813: W3A.A 37.57,4.87 38.81,6.11 38.81,11.75 | 38.81,13.18 38.81,14.45 39.21,14.76 40.57,14.76 W2A.K
N$35
  Top 0.406: IC1.8 55.66,29.15 55.24,28.73 C1.2 55.46,27.94 X1.2
N$36
  Top 0.406: IC1.7 54.86,29.46 54.29,28.89 53.82,28.89 53.5,28.57 C2.2 | C2.2 | X1.1 66.67,27.94 65.41,26.51 56.36,26.51 56.2,26.83 54.13,26.83 53.5,27.46 C2.2 | C2.2
N$37  (via drill 0.6)
  Top 0.813: v76.83,3.97 78.56,3.97 R_W.1
  Bottom 0.813: Q2.3 78.42,5.56 v76.83,3.97
N$38
  Top 0.406: R7.1 38.92,33.63 SJ9.2 35.35,33.63 R6.2
N$39
  Bottom 0.406: Q1.1 79.69,13.03 79.69,14.76 79.69,15.72 79.53,15.88 79.22,16.19 78.42,16.19 76.2,16.19 75.09,15.08 JP1T.6
N$40
  Top 0.813: JP1T.5 73.98,12.54
  Bottom 0.406: JP1T.5 75.09,12.54 76.52,11.11 77.47,10.16 Q2.1
N$41
  Top 0.813: JP1T.3 75.09,7.46 76.36,6.19 78.42,6.19 R_G.1
N$42
  Top 0.813: JP1T.4 78.21,10 R_B.1
N$43
  Bottom 0.813: JP1T.2 74.15,4.92 RD8.K
N$44
  Top 0.305: IC1.20 53.26,40.72 54.13,41.59 C7.2
N$45
  Top 0.305: SJ1.2 D1.2
N$46
  Top 0.305: SJ2.2 D2.2 | D2.2
N$47
  Top 0.305: SJ3.2 D3.2
N$48
  Top 0.406: SJ4.2 | SJ4.2 D4.2
N$50
  Top 0.305: SJ5.2 D5.2
N$51
  Top 0.305: SJ6.2 64.35,41.75 D6.2
N$52
  Top 0.406: D7.2 64.43,43.66 SJ7.2
N$53
  Top 0.305: R3.2 43.5,36.96 43.5,35.4 43.89,35.01 IC1.28
N$54
  Top 0.813: W1.K@1 W1A.K 53.87,15.4 42.07,15.4 40.74,16.73 W2A.A W2.A@2
N$55  (via drill 0.4)
  Top 0.305: 41.91,42.86 PB2.1 41.59,41.43 42.07,40.96 43.81,40.96 45.56,39.21 46.51,39.21 46.51,38.34 v47.78,38.34 | 54.69,37.07 v54.53,37.07 55.17,37.07 56.43,35.81 IC1.14
  Bottom 0.305: v54.53,37.07 54.53,36.99 52.86,36.99 52.39,36.51 49.21,36.51 47.78,37.94 v47.78,38.34
N$59
  Top 0.305: 48.81,35.81 IC1.27 44.59,35.81 arc90 R2.2
RE/DE  (via drill 0.4)
  Top 0.305: IC1.32 48.1,31.34 v48.1,28.42 | v48.1,28.42 47.47,29.05 IC3.3 | IC3.2 47.47,27.78 v48.1,28.42 | D2.1 67.34,33.15 67.63,32.86 68.1,32.86 68.26,32.7 68.26,30.32 67.31,29.37 64.77,29.37 63.9,28.5 v63.9,27.38
  Bottom 0.305: v48.1,28.42 48.42,28.1 61.91,27.94 62.23,28.26 63.02,28.26 v63.9,27.38 | v63.9,27.38
RS485A  (via drill 0.4, 0.6)
  Top 0.305: IC3.6 v38.34,29.05 38.1,29.29 38.1,31.91 37.31,31.91 37.31,32.65 SJ9.1
  Top 0.406: v1.59,29.53 2.86,30.16 A_L.1 2.7,33.34 3.02,33.66 11.91,33.66 12.38,34.13 12.38,36.04 12.7,36.35 14.45,36.35 14.92,36.83 15.72,36.83 15.79,36.91 XL.3 | XR.3 81.81,33.02 81.81,33.18 84.77,33.18 85.41,32.54 85.41,29.84 86.52,28.73 88.42,28.73 v88.98,28.26 | 95.09,30 95.09,30.48 95.41,30.16 A_R.1 arc-90 96.36,29.21 v95.41,29.21
  Bottom 0.305: 88.9,28.26 v88.98,28.26
  Bottom 0.406: v1.59,29.53 4.6,26.51 36.99,26.51 37.47,26.99 37.47,28.42 38.1,29.05 v38.34,29.05 38.89,29.05 39.37,28.57 39.37,26.83 39.69,26.51 87.15,26.51 88.9,28.26 | v88.98,28.26 94.46,28.26 v95.41,29.21
RS485B  (via drill 0.4, 0.6)
  Top 0.305: 95.25,26.67 96.52,26.67 B_R.1 | IC3.7 v38.34,27.78 37.47,27.78 37.47,31.27 33.81,31.27 32.86,32.23 31.38,32.23 SJ8.1
  Top 0.406: v1.59,26.67 2.22,26.51 B_L.1 3.81,26.51 5.87,26.51 5.87,30 6.03,30.16 13.65,30.16 14.45,30.96 14.45,32.54 15,33.09 XL.6 | 97.31,26.99 B_R.1 97.31,26.04 v95.41,26.04 | v89.69,26.04 90.01,26.35 90.01,29.69 87.47,29.69 86.52,30.64 86.52,32.07 87.31,33.02 87.31,35 85.65,36.67 85.41,36.91 XR.6 | IC3.7 40.34,27.92
  Bottom 0.406: 38.34,25.72 89.69,25.72 | 89.69,25.72 v89.69,26.04 | 89.69,25.72 | 38.34,25.72 v38.34,27.78 | 89.69,25.72 95.09,25.72 v95.41,26.04 | 38.34,25.72 2.54,25.72 v1.59,26.67
RST  (via drill 0.4, 0.4 pad 0.4)
  Top 0.305: 31.59,36.04 JP3B.5 | v29.21,35.72 28.65,35.16 26.67,35.16 25.96,34.45 25.96,32.78 24.13,32.78 22.7,31.35 22.7,29.61 21.75,29.61 21.75,28.73 21.59,28.57 11.43,28.57 10.95,29.05 v10.08,29.05 | R1.1 41.54,35.22 v41.99,34.77 43.58,33.18 45.88,33.18 46.91,34.21 IC1.29
  Top 0.406: 31.59,36.04 31.27,35.72 v29.21,35.72 | JP3A.5 6.03,32.38 v6.03,31.11
  Bottom 0.305: v29.21,35.72 30.64,35.72 30.8,35.88 30.8,36.2 31.43,36.83 38.1,36.83 39.05,35.88 40.96,35.88 41.99,34.85 v41.99,34.77
  Bottom 0.406: v10.08,29.05 6.67,29.05 6.03,29.69 v6.03,31.11
SCK  (via drill 0.4)
  Top 0.305: JP3B.3 30.8,38.58 v28.57,40.24 28.57,41.91 28.89,42.23 PB5.1 29.05,43.02 | v57.94,40.24 57.71,40.01 55.88,40.01 55.72,39.85 55.72,38.96 IC1.17 | JP3A.3 6.03,34.92 7.3,36.2 7.3,38.73 7.94,39.37 10.24,39.37 v11.27,40.4
  Bottom 0.305: v11.27,40.4 11.99,41.12 28.1,41.12 28.57,40.64 v28.57,40.24 29.02,40.28 30.04,40.28 30.88,41.12 38.89,41.12 40.16,39.85 50.01,39.85 50.64,40.48 56.12,40.48 56.59,40.01 57.71,40.01 v57.94,40.24
SPARE_B1  (via drill 0.4)
  Top 0.305: SW1.2 87,38.73 86.6,39.13 v86.6,39.69 | PB1.1 13.97,42.86 13.57,42.47 v13.57,39.61 | JP2.3 23.88,37.37 v24.13,37.62 | IC1.13 57.08,35.08 56.04,35.08 55.88,35.24 v55.17,35.24
  Top 0.406: 25.24,33.66 23.95,33.66 JP2.3
  Bottom 0.305: v86.6,39.69 85.57,38.26 62.39,38.26 60.17,36.04 55.88,36.04 55.72,35.88 | 55.72,35.88 | 55.24,35.4 55.72,35.88 | 55.24,35.4 53.34,35.4 53.18,35.24 48.26,35.24 47.47,36.04 42.23,36.04 41.59,36.67 39.05,36.67 38.26,37.47 31.27,37.47 30.48,36.67 28.89,36.67 25.4,36.67 25,36.67 v24.13,37.62 24.13,39.05 23.34,39.85 13.81,39.85 v13.57,39.61 | 55.24,35.4 55.17,35.32 v55.17,35.24
SPARE_C3  (via drill 0.4)
  Top 0.305: SW1.3 85.72,37.99 v85.72,40.64 | PC3.1 26.42,43.18 JP2.6 27.46,41.35 v27.46,38.97 | IC1.26 47.85,36.61 v47.07,37.39
  Bottom 0.305: v27.46,38.97 27.62,38.73 30.16,38.73 30.8,39.37 38.73,39.37 39.53,38.58 45.24,38.58 46.43,37.39 v47.07,37.39 48.58,35.88 52.86,35.88 53.18,36.2 55.09,36.2 55.56,36.67 59.77,36.67 62.15,39.05 84.14,39.05 v85.72,40.64
SPARE_C4  (via drill 0.4)
  Top 0.305: 24.92,38.73 25.32,38.34 v25.32,37.62 | R4.1 41.67,37.86 v42.62,36.99 42.86,36.75 42.86,34.92 43.6,34.18 R2.1 | 21.27,42.23 PC4.1
  Top 0.406: JP2.5 23.96,38.89 | 24.92,38.73 23.95,38.73 JP2.5 | JP2.5 23.8,38.73 22.54,38.73 22.54,40.64 21.27,41.91 21.27,42.23
  Bottom 0.305: v25.32,37.62 25.64,37.31 27.62,37.31 29.05,37.31 30.32,37.31 31.11,38.1 38.42,38.1 39.21,37.31 42.23,37.31 v42.62,36.99
SPARE_C5  (via drill 0.4)
  Top 0.305: 26.35,36.27 v26.35,38.73 26.35,39.37 25.72,40.01 24.29,40.01 23.65,40.64 PC5.1 | R5.1 43.29,39.69 R3.1 44.34,39.16 45.24,38.26 v45.24,37.39 | PC5.1
  Top 0.406: 27.78,36.35 27.7,36.27 JP2.4 26.35,36.27
  Bottom 0.305: v26.35,38.73 26.99,38.1 30.32,38.1 30.96,38.73 38.58,38.73 39.37,37.94 44.69,37.94 v45.24,37.39
TXD  (via drill 0.4)
  Top 0.305: IC1.31 47.53,32.61 46.67,31.75 46.67,30.82 IC3.4 45.09,30.32 44.29,29.53 v44.29,28.57 | D1.1 67.31,31.48 67.31,30.64 66.83,30.16 63.98,30.16 62.55,28.73 v62.55,27.38
  Bottom 0.305: v44.29,28.57 45.56,27.3 61.91,27.23 62.39,27.23 v62.55,27.38
V+
  Top 0.406: U1A.A U1.P$2
  Top 0.813: G1.A 27.46,6.9 27.46,3.34 27.46,3.02 26.51,2.06 26.51,1.46 R_R.2 26.51,1.3 26.51,1.91 | W1A.A W1.A@2
  Bottom 0.813: G1.A 31.24,10.68 B1.A 31.24,14.3 U1A.A 34.41,18.77 arc90 34.29,18.89 | JP1T.7 73.53,18.89 53.34,18.89 | 34.29,18.89 20.76,18.89 arc90 P+18T.1 | 34.29,18.89 53.34,18.89 | W1A.A 53.4,18.83 53.34,18.89
VCC  (via drill 0.4)
  Top 0.305: PAD3.1 38.89,43.18 | 38.89,43.18
  Top 0.406: IC1.6 54.06,31.34 54.06,31.36 54.29,31.59 54.29,32.54 53.9,32.94 52.78,32.94 52.7,32.86 | R8.1 29.45,31.51 29.53,31.43 | 46.88,40.8 L1.1 | 41.12,26.51 41.91,25.72 47.78,25.72 47.78,27.15 48.1,27.46 49.69,27.46 49.95,27.73 C5.1 50.8,27.78 52.46,29.45 IC1.4 52.46,31.36 52.23,31.59 52.23,32.38 52.7,32.86 | 52.7,32.86
  Top 0.61: IC4.1 34.92,26.51 | IC4.1 33.66,26.51 32.38,26.51 32.38,30.96 32.38,31.43 29.53,31.43 27.78,31.43 | 38.89,43.18 PAD4.1 | JP2.2 26.66,31.43 27.78,31.43 | C4.1 27.78,29 27.78,31.43 | IC4.1 IC3.8 41.12,26.51 41.27,26.51 41.75,26.99 41.75,31.43 40.96,32.23 40.96,34.61 39.74,35.83 R1.2 | R1.2 | R1.2 R4.2 | R4.2 | R4.2 R5.2 39.74,40.8 | 39.74,40.8 39.74,42.41 PAD3.1 | 39.74,40.8 v40.64,40.8 | v45.96,40.8 46.88,40.8
  Bottom 0.61: v40.64,40.8 v45.96,40.8

### Text on the board
tNames: +18 | GND | GND | +5V | +5V | 7 | 1 | 1 | 32 | +18 | 16 | 1 | 8 | +18 | 6 | 4 | 2 | 6 | 1 | A | A | 1 | 6 | B | B | 1 | +18V | 7 | GND | +5V | B1 | C5 | C4 | 6 | 1 | C3
bStop: PentaFnord | ControlBoard 0.9b | https://www.c3d2.de/wiki/PentaFnord | PentaFnord | LedBoard 0.9b